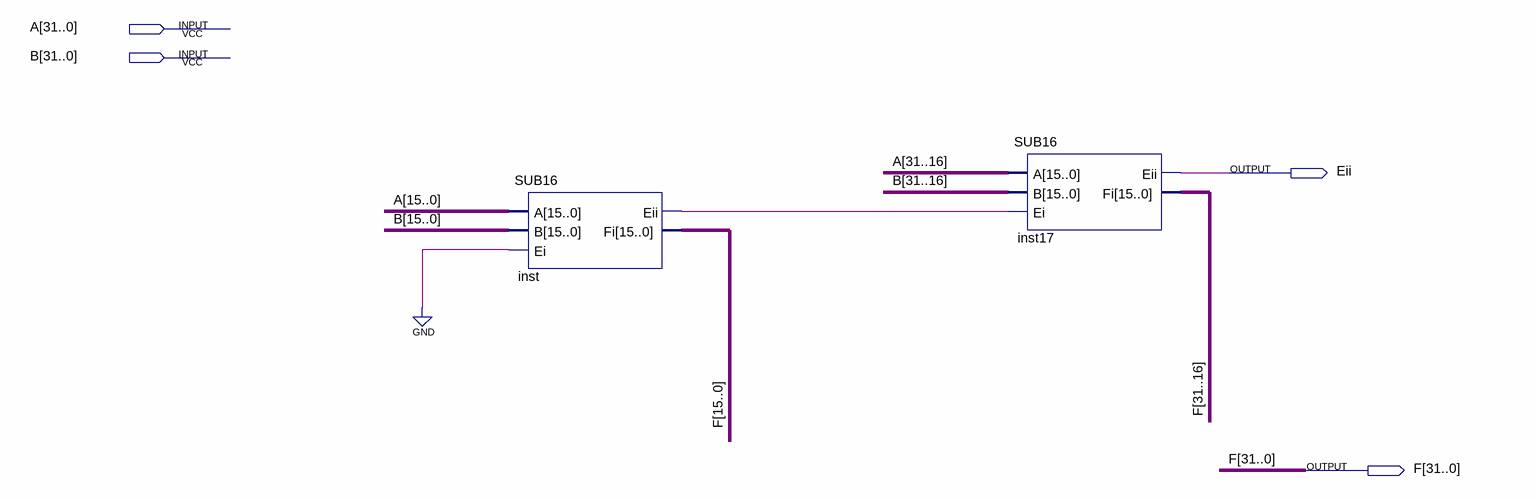
[diagram p0: schematic sheet]
// Quartus schematic SUB32.bdf as structural Verilog: 2 symbols, 4 pins
module SUB32 (
  input  [31:0] A,
  input  [31:0] B,
  output Eii,
  output [31:0] F
);

  wire inst_eii;

  SUB16 inst (.A(A[15:0]), .B(B[15:0]), .Ei(1'b0), .Eii(inst_eii), .Fi(F[15:0]));
  SUB16 inst17 (.A(A[31:16]), .B(B[31:16]), .Ei(inst_eii), .Eii(Eii), .Fi(F[31:16]));
endmodule
